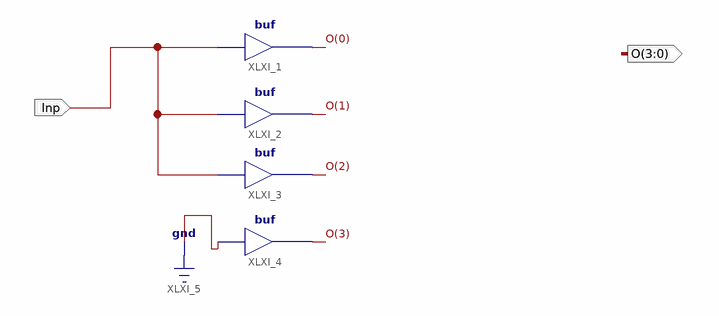
[diagram p0: schematic sheet 1]
// Xilinx ISE schematic shiftbit.sch (spartan6) as structural Verilog: 4 symbols, 2 ports
module shiftbit (
  input  Inp,
  output [3:0] O
);

  buf XLXI_1 (O[0], Inp);
  buf XLXI_2 (O[1], Inp);
  buf XLXI_3 (O[2], Inp);
  buf XLXI_4 (O[3], 1'b0);
endmodule
